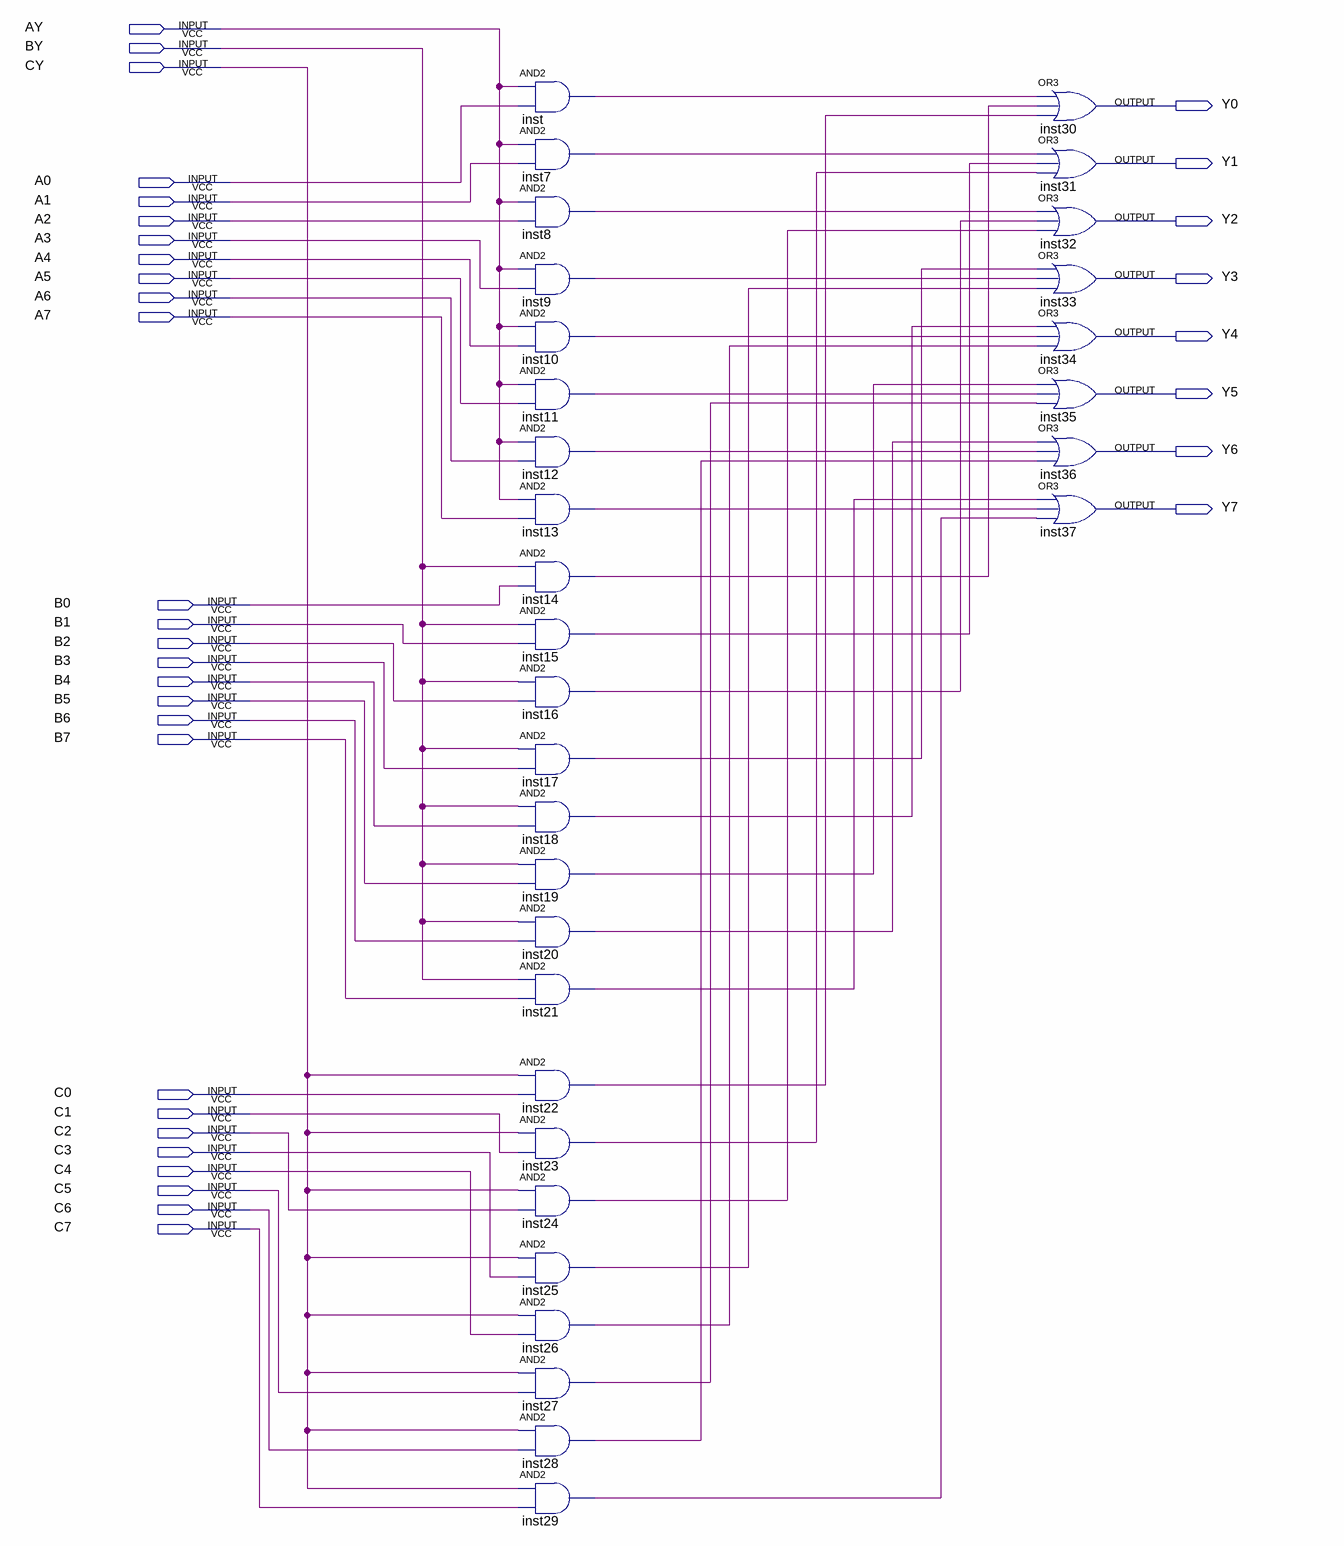
[diagram p0: schematic sheet]
// Quartus schematic x8_3_1.bdf as structural Verilog: 32 symbols, 35 pins
module x8_3_1 (
  input  AY,
  input  BY,
  input  CY,
  input  A0,
  input  A1,
  input  A2,
  input  A3,
  input  A4,
  input  A5,
  input  A6,
  input  A7,
  input  B0,
  input  B1,
  input  B2,
  input  B3,
  input  B4,
  input  B5,
  input  B6,
  input  B7,
  input  C0,
  input  C1,
  input  C2,
  input  C3,
  input  C4,
  input  C5,
  input  C6,
  input  C7,
  output Y0,
  output Y1,
  output Y2,
  output Y3,
  output Y4,
  output Y5,
  output Y6,
  output Y7
);

  wire inst7_out, inst8_out, inst9_out, inst10_out, inst11_out, inst12_out, inst13_out, inst14_out,
       inst15_out, inst16_out, inst17_out, inst18_out, inst19_out, inst20_out, inst21_out, inst22_out,
       inst23_out, inst24_out, inst25_out, inst26_out, inst27_out, inst28_out, inst29_out, inst_out;

  and inst (inst_out, AY, A0);
  and inst7 (inst7_out, AY, A1);
  and inst8 (inst8_out, AY, A2);
  and inst9 (inst9_out, AY, A3);
  and inst10 (inst10_out, AY, A4);
  and inst11 (inst11_out, AY, A5);
  and inst12 (inst12_out, AY, A6);
  and inst13 (inst13_out, AY, A7);
  and inst14 (inst14_out, BY, B0);
  and inst15 (inst15_out, BY, B1);
  and inst16 (inst16_out, BY, B2);
  and inst17 (inst17_out, BY, B3);
  and inst18 (inst18_out, BY, B4);
  and inst19 (inst19_out, BY, B5);
  and inst20 (inst20_out, BY, B6);
  and inst21 (inst21_out, BY, B7);
  and inst22 (inst22_out, CY, C0);
  and inst23 (inst23_out, CY, C1);
  and inst24 (inst24_out, CY, C2);
  and inst25 (inst25_out, CY, C3);
  and inst26 (inst26_out, CY, C4);
  and inst27 (inst27_out, CY, C5);
  and inst28 (inst28_out, CY, C6);
  and inst29 (inst29_out, CY, C7);
  or inst30 (Y0, inst_out, inst14_out, inst22_out);
  or inst31 (Y1, inst7_out, inst15_out, inst23_out);
  or inst32 (Y2, inst8_out, inst16_out, inst24_out);
  or inst33 (Y3, inst17_out, inst9_out, inst25_out);
  or inst34 (Y4, inst18_out, inst10_out, inst26_out);
  or inst35 (Y5, inst19_out, inst11_out, inst27_out);
  or inst36 (Y6, inst20_out, inst12_out, inst28_out);
  or inst37 (Y7, inst21_out, inst13_out, inst29_out);
endmodule
